# Altium schematic sheet Diesel_control.SchDoc
size A2; SheetNumber: 1; SheetTotal: 1
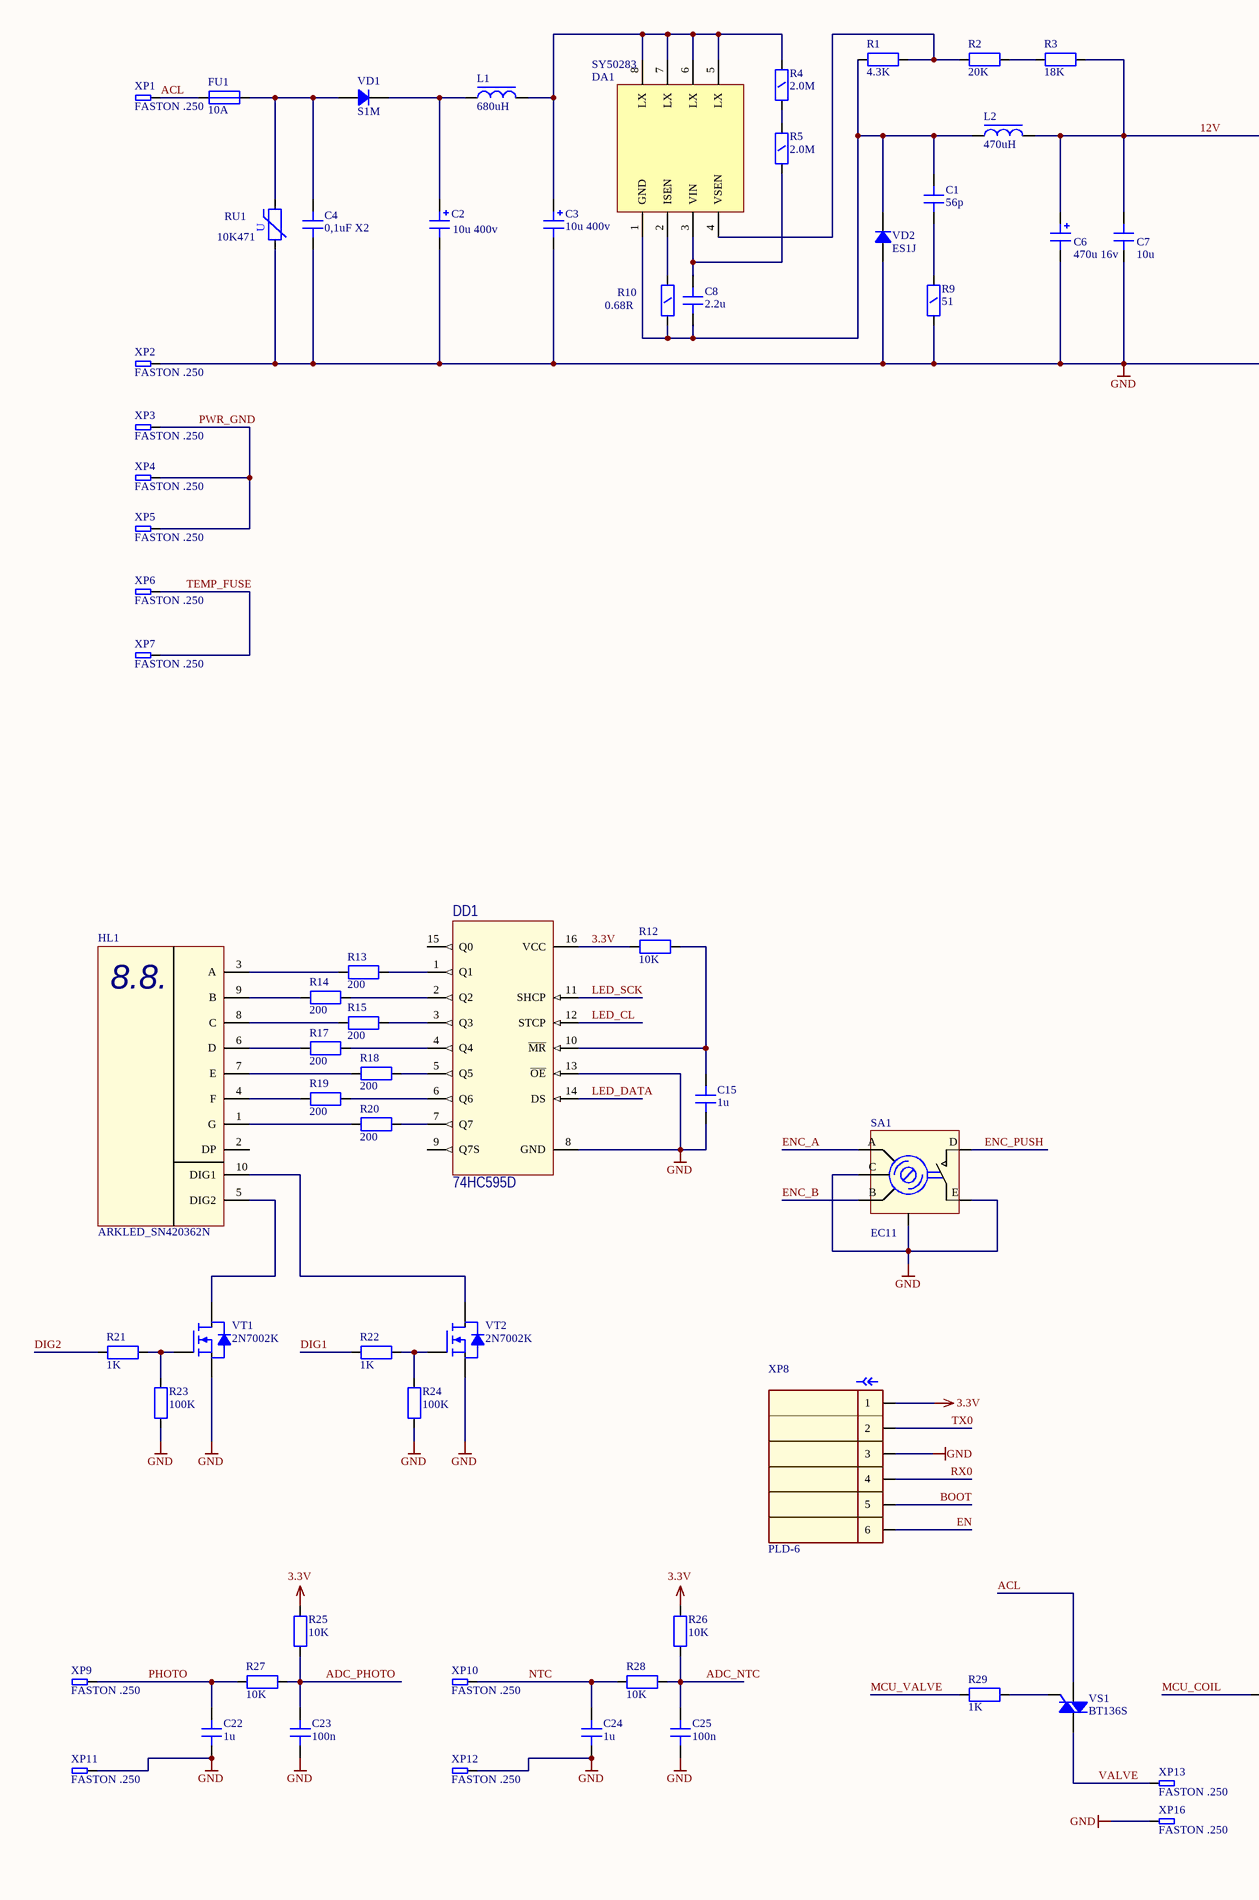
[diagram p0: Diesel_control.SchDoc, left]
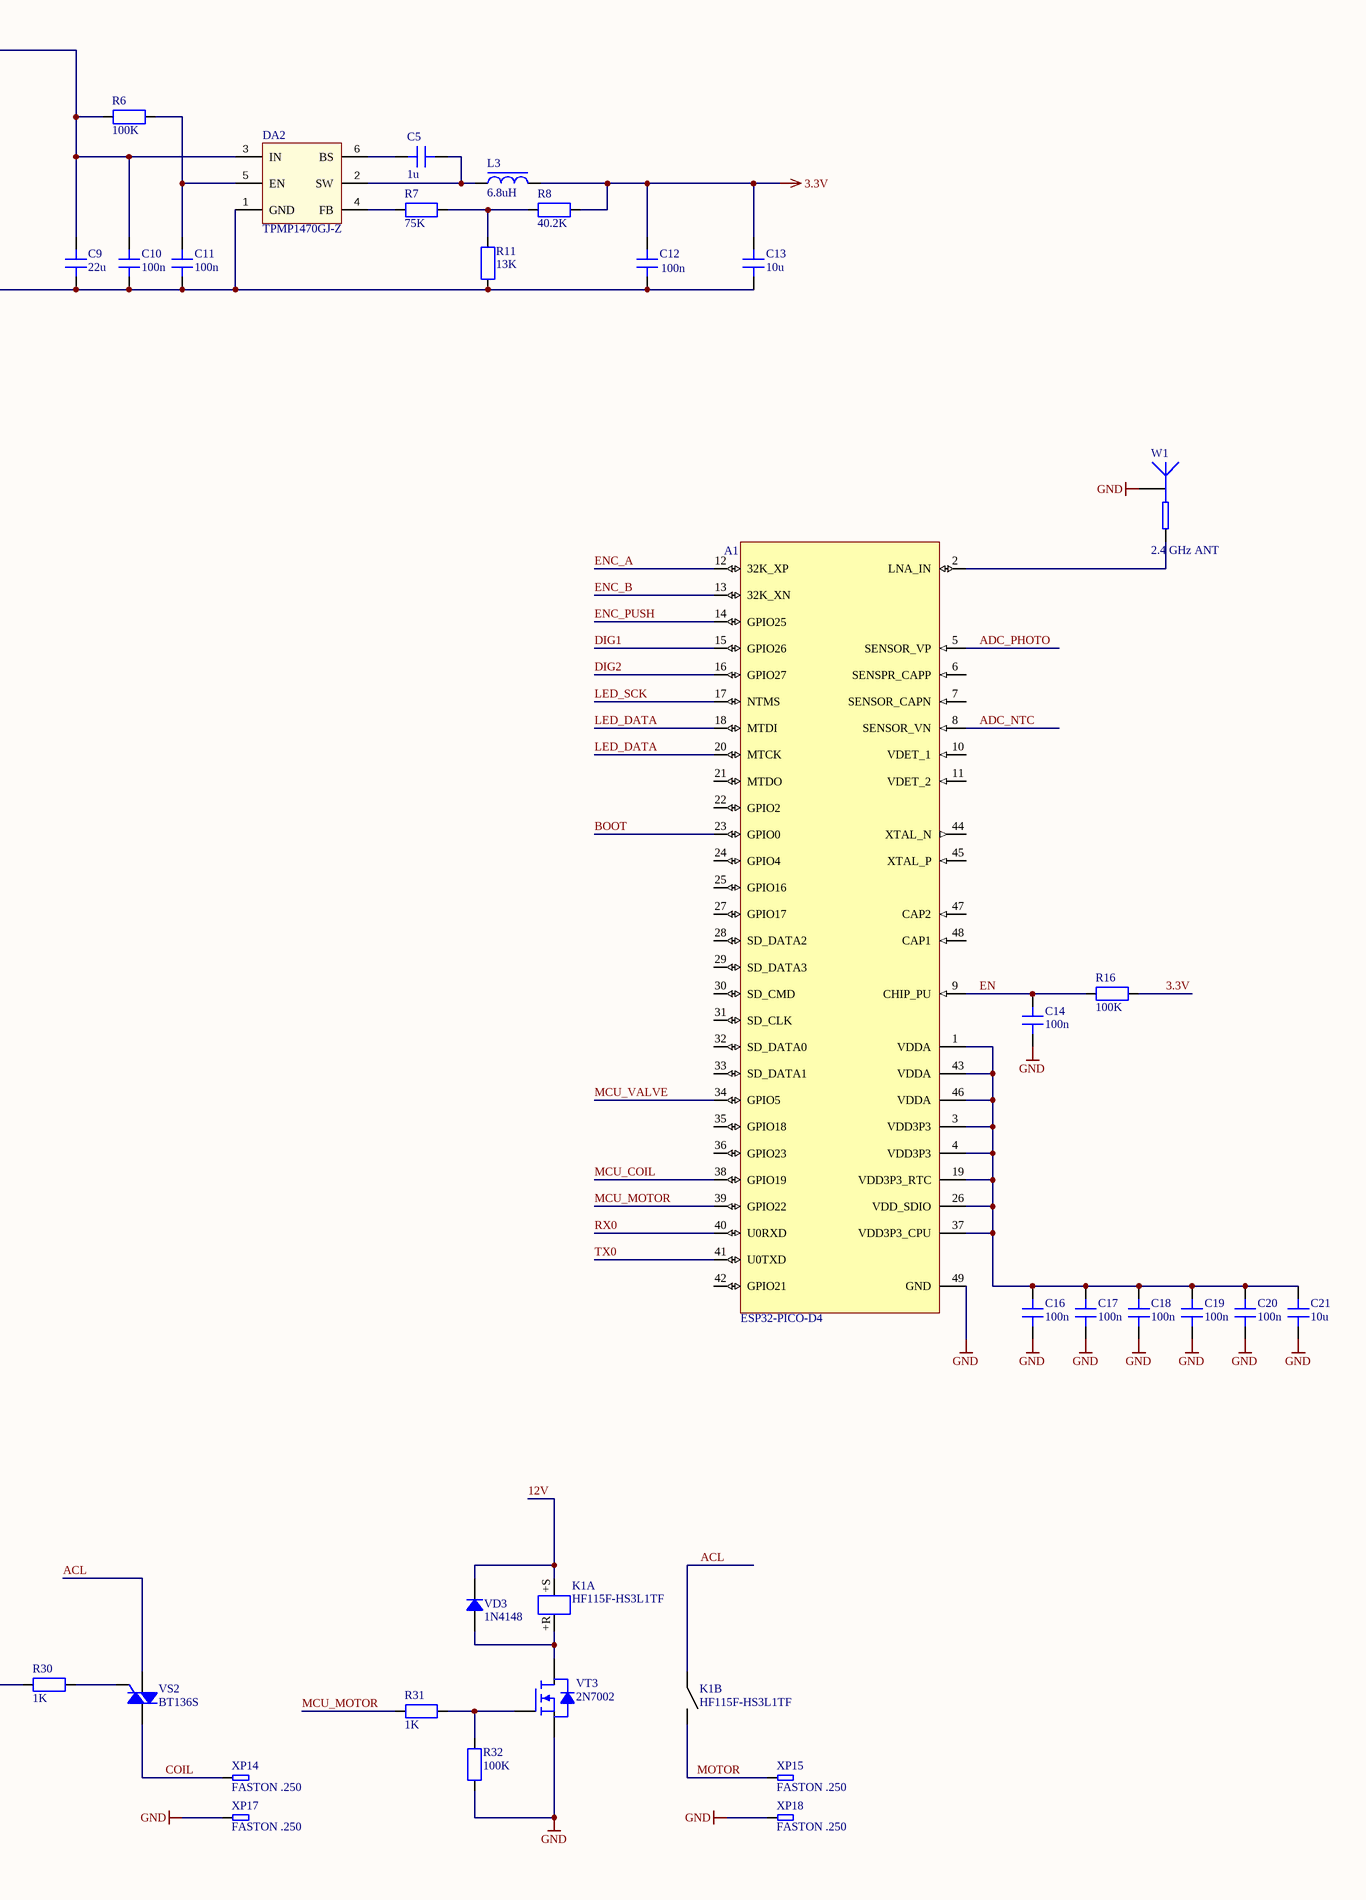
[diagram p1: Diesel_control.SchDoc, right]

## Parts
A1  ESP32-PICO-D4  [ESP32_PICO_D4]
C1  56p  [C1206]
C2  10u 400v  [CE12.5X20-P5.0]
C3  10u 400v  [CE12.5X20-P5.0]
C4  0,1uF X2  [CAP_FILM_6X13X12(PITCH=10mm)]
C5  1u  [C0603]
C6  470u 16v  [CE8x12MM-P3.5]
C7  10u  [C1206]
C8  2.2u  [C0603]
C9  22u  [C1206]
C10  100n  [C0603]
C11  100n  [C0603]
C12  100n  [C0603]
C13  10u  [C0805]
C14  100n  [C0603]
C15  1u  [C0603]
C16  100n  [C0603]
C17  100n  [C0603]
C18  100n  [C0603]
C19  100n  [C0603]
C20  100n  [C0603]
C21  10u  [C0603]
C22  1u  [C0603]
C23  100n  [C0603]
C24  1u  [C0603]
C25  100n  [C0603]
DA1  SY50283  [SO-8]
DA2  TPMP1470GJ-Z  [SOT-23-6]
DD1  74HC595D  [SO-16]
FU1  10A  [Axial_215]
HL1  ARKLED_SN420362N  [7_seg_double_CK]
K1  HF115F-HS3L1TF  [HF115F-A]  (parts A,B of 2)
L1  680uH  [PK0608]
L2  470uH  [GCRH129]
L3  6.8uH  [SCCD54]
R1  4.3K  [R0603]
R2  20K  [R0603]
R3  18K  [R0603]
R4  2.0M  [R1206]
R5  2.0M  [R1206]
R6  100K  [R0603]
R7  75K  [R0603]
R8  40.2K  [R0603]
R9  51  [R1206]
R10  0.68R  [R1206]
R11  13K  [R0603]
R12  10K  [R0603]
R13  200  [R0603]
R14  200  [R0603]
R15  200  [R0603]
R16  100K  [R0603]
R17  200  [R0603]
R18  200  [R0603]
R19  200  [R0603]
R20  200  [R0603]
R21  1K  [R0603]
R22  1K  [R0603]
R23  100K  [R0603]
R24  100K  [R0603]
R25  10K  [R0603]
R26  10K  [R0603]
R27  10K  [R0603]
R28  10K  [R0603]
R29  1K  [R0603]
R30  1K  [R0603]
R31  1K  [R0603]
R32  100K  [R0603]
RU1  10K471  [Varistor_D10_P=7.5mm]
SA1  EC11  [EC11-20F]
VD1  S1M  [SMA_DIODE]
VD2  ES1J  [SMA_DIODE]
VD3  1N4148  [SOD-323_DIODE]
VS1  BT136S  [TO-252-3]
VS2  BT136S  [TO-252-3]
VT1  2N7002K  [SOT-23-3]
VT2  2N7002K  [SOT-23-3]
VT3  2N7002  [SOT-23-3]
W1  2.4 GHz ANT  [PIFA_2.4MHz]  (no BOM)
XP1  FASTON .250  [1217861-1]
XP2  FASTON .250  [1217861-1]
XP3  FASTON .250  [1217861-1]
XP4  FASTON .250  [1217861-1]
XP5  FASTON .250  [1217861-1]
XP6  FASTON .250  [1217861-1]
XP7  FASTON .250  [1217861-1]
XP8  PLD-6  [PLD-6]
XP9  FASTON .250  [1217861-1]
XP10  FASTON .250  [1217861-1]
XP11  FASTON .250  [1217861-1]
XP12  FASTON .250  [1217861-1]
XP13  FASTON .250  [1217861-1]
XP14  FASTON .250  [1217861-1]
XP15  FASTON .250  [1217861-1]
XP16  FASTON .250  [1217861-1]
XP17  FASTON .250  [1217861-1]
XP18  FASTON .250  [1217861-1]

## Nets
3.3V: DD1.16(VCC) R12.1 R16.2 R25.2 R26.2 XP8.1
GND: A1.49(GND) C2.- C3.- C4.1 C6.- C7.1 C9.1 C10.1 C11.1 C12.1 C13.1 C14.1 C15.1 C16.1 C17.1 C18.1 C19.1 C20.1 C21.1 C22.1 C23.1 C24.1 C25.1 DA2.1(GND) DD1.8(GND) DD1.13(~{OE}) R9.1 R11.1 R23.1 R24.1 R32.1 RU1.1 SA1.C SA1.E SA1.GND VD2.A VT1.Z(S) VT2.Z(S) VT3.Z(S) W1.1 XP2.1 XP8.3 XP11.1 XP12.1 XP16.1 XP17.1 XP18.1
12V: C6.+ C7.2 C9.2 C10.2 DA2.3(IN) K1.A1(+S) L2.2 R3.2 R6.1 VD3.C
ACL: FU1.1 K1.11 VS1.X(A1) VS2.X(A1) XP1.1
ADC_NTC: A1.8(SENSOR_VN) C25.2 R26.1 R28.2
ADC_PHOTO: A1.5(SENSOR_VP) C23.2 R25.1 R27.2
BOOT: A1.23(GPIO0) XP8.5
COIL: VS2.Y(A2) XP14.1
DIG1: A1.15(GPIO26) R22.1
DIG2: A1.16(GPIO27) R21.1
EN: A1.9(CHIP_PU) C14.2 R16.1 XP8.6
ENC_A: A1.12(32K_XP) SA1.A
ENC_B: A1.13(32K_XN) SA1.B
ENC_PUSH: A1.14(GPIO25) SA1.D
LED_CL: DD1.12(STCP)
LED_DATA: A1.18(MTDI) A1.20(MTCK) DD1.14(DS)
LED_SCK: A1.17(NTMS) DD1.11(SHCP)
MCU_COIL: A1.38(GPIO19) R30.1
MCU_MOTOR: A1.39(GPIO22) R31.2
MCU_VALVE: A1.34(GPIO5) R29.1
MOTOR: K1.14 XP15.1
NTC: C24.2 R28.1 XP10.1
PHOTO: C22.2 R27.1 XP9.1
PWR_GND: XP3.1 XP4.1 XP5.1
RX0: A1.40(U0RXD) XP8.4
TEMP_FUSE: XP6.1 XP7.1
TX0: A1.41(U0TXD) XP8.2
VALVE: VS1.Y(A2) XP13.1
NetA1_1: A1.1(VDDA) A1.3(VDD3P3) A1.4(VDD3P3) A1.19(VDD3P3_RTC) A1.26(VDD_SDIO) A1.37(VDD3P3_CPU) A1.43(VDDA) A1.46(VDDA) C16.2 C17.2 C18.2 C19.2 C20.2 C21.2
NetA1_2: A1.2(LNA_IN) W1.2
NetC1_1: C1.1 R9.2
NetC1_2: C1.2 C8.1 DA1.1(GND) L2.1 R1.1 R10.1 VD2.C
NetC2_+: C2.+ L1.1 VD1.C
NetC3_+: C3.+ DA1.5(LX) DA1.6(LX) DA1.7(LX) DA1.8(LX) L1.2 R4.2
NetC4_2: C4.2 FU1.2 RU1.2 VD1.A
NetC5_1: C5.1 DA2.6(BS)
NetC5_2: C5.2 DA2.2(SW) L3.1
NetC8_2: C8.2 DA1.3(VIN) R5.1
NetC11_2: C11.2 DA2.5(EN) R6.2
NetC12_2: C12.2 C13.2 L3.2 R8.2
NetC15_2: C15.2 DD1.10(~{MR}) R12.2
NetDA1_2: DA1.2(ISEN) R10.2
NetDA1_4: DA1.4(VSEN) R1.2 R2.1
NetDA2_4: DA2.4(FB) R7.1
NetDD1_1: DD1.1(Q1) R13.2
NetDD1_2: DD1.2(Q2) R14.2
NetDD1_3: DD1.3(Q3) R15.2
NetDD1_4: DD1.4(Q4) R17.2
NetDD1_5: DD1.5(Q5) R18.2
NetDD1_6: DD1.6(Q6) R19.2
NetDD1_7: DD1.7(Q7) R20.2
NetHL1_1: HL1.1(G) R20.1
NetHL1_3: HL1.3(A) R13.1
NetHL1_4: HL1.4(F) R19.1
NetHL1_5: HL1.5(DIG2) VT1.Y(D)
NetHL1_6: HL1.6(D) R17.1
NetHL1_7: HL1.7(E) R18.1
NetHL1_8: HL1.8(C) R15.1
NetHL1_9: HL1.9(B) R14.1
NetHL1_10: HL1.10(DIG1) VT2.Y(D)
NetK1_A2: K1.A2(+R) VD3.A VT3.Y(D)
NetR2_2: R2.2 R3.1
NetR4_1: R4.1 R5.2
NetR7_2: R7.2 R8.1 R11.2
NetR21_2: R21.2 R23.2 VT1.X(G)
NetR22_2: R22.2 R24.2 VT2.X(G)
NetR29_2: R29.2 VS1.Z(G)
NetR30_2: R30.2 VS2.Z(G)
NetR31_1: R31.1 R32.2 VT3.X(G)

Not connected (* = marked no-connect by the designer): A1 6(SENSPR_CAPP) 7(SENSOR_CAPN) 10(VDET_1) 11(VDET_2) 21(MTDO) 22(GPIO2) 24(GPIO4) 25(GPIO16) 27(GPIO17) 28(SD_DATA2) 29(SD_DATA3) 30(SD_CMD) 31(SD_CLK) 32(SD_DATA0) 33(SD_DATA1) 35(GPIO18) 36(GPIO23) 42(GPIO21) 44(XTAL_N) 45(XTAL_P) 47(CAP2) 48(CAP1); DD1 9(Q7S) 15(Q0); HL1 2(DP)

## Notes on the sheet
- Labels drawn without touching a wire or pin: 3.3V
- (in symbol 1436) U
- (in symbol 3577) 8.8.

## Library data of the parts
A1 = 3638: Bluetooth, WiFi 802.11b/g/n, Bluetooth v4.2 + EDR, Class 1, 2 and 3 Transceiver Module 2.4GHz ~ 2.5GHz  Surface Mount; Manufacturer: Expressif; ID: 3638; LCPN: C193707; Type: Modules; MFPN: ESP32-PICO-D4; Value: ESP32-PICO-D4; Footprint Type: SMD; Supplier: LC; URL: https://lcsc.com/product-detail/Others_Espressif-Systems-ESP32-PICO-D4_C193707.html; Symbol: ESP32_PICO_D4
C1 = 3645: 56pF ±5% 1kV C0G,NP0 1206 Multilayer Ceramic Capacitors MLCC - SMD/SMT RoHS; Manufacturer: IHHEC(HOLY STONE ENTERPRISE CO., LTD); ID: 3645; MFPN: C1206N560J102T; LCPN: C105999; Type: Capacitors; Value: 56p; Footprint Type: SMD; Supplier: LC; URL: https://lcsc.com/product-detail/Multilayer-Ceramic-Capacitors-MLCC-SMD-SMT_IHHEC-HOLY-STONE-ENTERPRISE-CO-LTD-C1206N560J102T_C105999.html; Symbol: Capacitor
C2 C3 = 1407: 10u, 400v, Aluminium electrolitic capaсitor, radial, D=12.5mm, H=20mm, +105°C; ID: 1407; Type: Capacitors; Value: 10u; Footprint Type: TH; Symbol: Capacitor_polarised
C4 = 3608: Film Capacitor X2, 310V 0,1uF ±10% -40℃...+110℃; Manufacturer: KNSCHA; ID: 3608; Type: Capacitors; MFPN: MPX104K31C3KN15600; Value: 100n; LCPN: C489079; Footprint Type: TH; Supplier: LC; URL: https://lcsc.com/product-detail/Suppression-Capacitors_KNSCHA-MPX104K31C3KN15600_C489079.html; Symbol: Capacitor
C5 C15 C22 C24 = 1246: Cap Ceramic, 0603, ±10%, 50V, X7R (X5R), -55 +125C (-55 +85C); ID: 1246; Type: Capacitors; MFPN: CL10A105KO8NNNC; LCPN: C1592; Value: 1u; Footprint Type: SMD; URL: https://lcsc.com/product-detail/Multilayer-Ceramic-Capacitors-MLCC-SMD-SMT_Samsung-Electro-Mechanics-CL10A105KO8NNNC_C1592.html; Symbol: Capacitor
C6 = 1428: 470u, 16v, Aluminium electrolitic capaсitor, radial, D=8mm, H=12mm, +105°C; ID: 1428; Type: Capacitors; Value: 470u; Footprint Type: TH; Symbol: Capacitor_polarised
C7 = 1383: Cap Ceramic, 1206, ±10%, 25V, X7R (X5R), -55 +125C (-55 +85C); ID: 1383; Type: Capacitors; MFPN: CL31A106KBHNNNE; LCPN: C13585; Value: 10u; Footprint Type: SMD; URL: https://lcsc.com/product-detail/Multilayer-Ceramic-Capacitors-MLCC-SMD-SMT_Samsung-Electro-Mechanics-CL31A106KBHNNNE_C13585.html; Symbol: Capacitor
C8 = 1250: Cap Ceramic, 0603, ±10%, 25V, X7R (X5R), -55 +125C (-55 +85C); ID: 1250; Type: Capacitors; Value: 2.2u; Footprint Type: SMD; Symbol: Capacitor
C9 = 1384: Cap Ceramic, 1206, ±10%, 25V, X7R (X5R), -55 +125C (-55 +85C); ID: 1384; Type: Capacitors; Value: 22u; Footprint Type: SMD; Symbol: Capacitor
C10-C12 C14 C16-C20 C23 C25 = 1234: Cap Ceramic, 0603, ±10%, 50V, X7R (X5R), -55 +125C (-55 +85C); ID: 1234; Type: Capacitors; MFPN: 0603B104K500NT; LCPN: C187860; Value: 100n; Footprint Type: SMD; URL: https://lcsc.com/product-detail/Multilayer-Ceramic-Capacitors-MLCC-SMD-SMT_YAGEO-CC0603KRX7R9BB104_C14663.html; Symbol: Capacitor
C13 = 1331: Cap Ceramic, 0805, ±10%, 50V, X7R (X5R), -55 +125C (-55 +85C); ID: 1331; Type: Capacitors; LCPN: C17024; Value: 10u; Footprint Type: SMD; Symbol: Capacitor
C21 = 1258: Cap Ceramic, 0603, ±10%, 6.3V, X7R (X5R), -55 +125C (-55 +85C); ID: 1258; Type: Capacitors; Value: 10u; Footprint Type: SMD; Symbol: Capacitor
DA1 = 3641: Buck Regulator; Manufacturer: Silergy Corp; ID: 3641; MFPN: SY50283FAC; LCPN: C492740; Type: Microschemes; Value: SY50283; Footprint Type: SMD; Supplier: LC; URL: https://lcsc.com/product-detail/LED-Drivers_Silergy-Corp-SY50283FAC_C492740.html; Symbol: SY50283
DA2 = 3646: SOT23-6 DC-DC Converters RoHS; Manufacturer: TECH PUBLIC; ID: 3646; LCPN: C558426; Type: Microschemes; MFPN: TPMP1470GJ-Z; Value: TPMP1470GJ-Z; Footprint Type: SMD; Supplier: LC; URL: https://lcsc.com/product-detail/DC-DC-Converters_TECH-PUBLIC-TPMP1470GJ-Z_C558426.html; Symbol: TPMP1470GJ-Z
DD1 = 3557: Shift Register Serial to parallel, serial SOIC-16_150mil; Manufacturer: Shenzhen Fuman Elec; ID: 3557; MFPN: 74HC595D,118; LCPN: C2798023; Type: Microschemes; Value: 74HC595D; Footprint Type: SMD; Supplier: LC; URL: https://lcsc.com/product-detail/74-Series_Nexperia-74HC595D-118_C5947.html; Symbol: 74HC595D
FU1 = 3611: Glass Tube Fuse Delayed blow/Slow Blow 10A 250V Axial,5x20mm; Manufacturer: Littelfuse; ID: 3611; MFPN: 0218010.MXEP; LCPN: C142774; Type: Fuses; Value: 10A; Footprint Type: TH; Supplier: LC; URL: https://lcsc.com/product-detail/Cartridge-Fuses_Littelfuse-0218010-MXEP_C142774.html; Symbol: Fuse
HL1 = 3577: 2 0.36''(9.14mm) Cathode(Negative electrode) Red 633nm Through Hole Led Segment Display RoHS; Manufacturer: ARKLED(Wuxi ARK Tech Elec); ID: 3577; Type: Displays; LCPN: C193138; MFPN: SN420362N; Value: ARKLED_SN420362N; Footprint Type: TH; Supplier: LC; URL: https://lcsc.com/product-detail/Led-Segment-Display_ARKLED-Wuxi-ARK-Tech-Elec-SN420362N_C193138.html; Symbol: 7_segment_double_CK
K1 = 1496: Miniature High Power Latching Relay, 1 Coil, 20A, 5VDC; Manufacturer: HONGFA RELAY; MFPN: HF115F-L/5-HS3L1TF; ID: 1496; Value: HF115F-L/12-HS3L1TF; Supplier: BIG; Type: Relays; Footprint Type: TH; Symbol: RELAY_POL_L1_1A
L1 = 3642: 680uH ±20% 250mA 2.5Ω Power Inductors RoHS; Manufacturer: SXN(Shun Xiang Nuo Elec); ID: 3642; MFPN: PK0608-681MB; LCPN: C400306; Type: Inductors; Value: 680uH; Footprint Type: TH; Supplier: LC; URL: https://lcsc.com/product-detail/Power-Inductors_SXN-Shun-Xiang-Nuo-Elec-PK0608-681MB_C400306.html; Symbol: Drossel
L2 = 3643: 470uH ±20% 1A 600mΩ SMD,12.3x12.3x10mm(max) Power Inductors RoHS; Manufacturer: GLE; ID: 3643; MFPN: GCRH129-471MC; LCPN: C439430; Type: Inductors; Value: 470uH; Footprint Type: SMD; Supplier: LC; URL: https://lcsc.com/product-detail/Power-Inductors_GLE-GCRH129-471MC_C439430.html; Symbol: Drossel
L3 = 3647: 6.8uH ±20% 2A 70mΩ SMD,5.8x5.2x4.5mm Power Inductors RoHS; Manufacturer: Yanchuang; ID: 3647; MFPN: SCCD54-6R8MT; LCPN: C532871; Type: Inductors; Value: 6.8uH; Footprint Type: SMD; Supplier: LC; Symbol: Drossel
R1 = 88: Res, 0603, 1%, 1/10W; Manufacturer: FH(Guangdong Fenghua Advanced Tech); ID: 88; MFPN: RS-03K4301FT; LCPN: C310281; Type: Resistors; Value: 4.3K; Footprint Type: SMD; Supplier: JLC; URL: https://lcsc.com/product-detail/Chip-Resistor-Surface-Mount_FH-Guangdong-Fenghua-Advanced-Tech-RS-03K4301FT_C310281.html; Symbol: Resistor
R2 = 104: Res, 0603, 1%, 1/10W; Manufacturer: YAGEO; ID: 104; MFPN: RC0603FR-0720KL; LCPN: C105575; Type: Resistors; Value: 20K; Footprint Type: SMD; Supplier: JLC; URL: https://lcsc.com/product-detail/Chip-Resistor-Surface-Mount_20KR-2002-1_C105575.html; Symbol: Resistor
R3 = 103: Res, 0603, 1%, 1/10W; Manufacturer: FH(Guangdong Fenghua Advanced Tech); ID: 103; MFPN: RS-03K1802FT; LCPN: C140113; Type: Resistors; Value: 18K; Footprint Type: SMD; Supplier: JLC; URL: https://lcsc.com/product-detail/Chip-Resistor-Surface-Mount_FH-Guangdong-Fenghua-Advanced-Tech-RS-03K1802FT_C140113.html; Symbol: Resistor
R4 R5 = 490: Res, 1206, 5%, 1/4W; ID: 490; Type: Resistors; Value: 2.0M; Footprint Type: SMD; Symbol: Resistor_1/4W
R6 R16 R23 R24 R32 = 121: Res, 0603, 1%, 1/10W; Manufacturer: UNI-ROYAL(Uniroyal Elec); ID: 121; MFPN: 0603WAF1003T5E; LCPN: C25803; Type: Resistors; Value: 100K; Footprint Type: SMD; Supplier: JLC; URL: https://lcsc.com/product-detail/Chip-Resistor-Surface-Mount_UNI-ROYAL-Uniroyal-Elec-0603WAF1003T5E_C25803.html; Symbol: Resistor
R7 = 118: Res, 0603, 1%, 1/10W; Manufacturer: UNI-ROYAL(Uniroyal Elec); ID: 118; MFPN: 0603WAF7502T5E; LCPN: C23242; Type: Resistors; Value: 75K; Footprint Type: SMD; Supplier: JLC; URL: https://lcsc.com/product-detail/Chip-Resistor-Surface-Mount_UNI-ROYAL-Uniroyal-Elec-0603WAF7502T5E_C23242.html; Symbol: Resistor
R8 = 3649: Res, 0603, 1%, 1/10W; Manufacturer: UNI-ROYAL(Uniroyal Elec); ID: 3649; MFPN: 0603WAF4022T5E; LCPN: C12447; Type: Resistors; Value: 40.2K; Footprint Type: SMD; Supplier: LC; Symbol: Resistor
R9 = 380: Res, 1206, 1%, 1/4W; ID: 380; Type: Resistors; Value: 51; Footprint Type: SMD; Symbol: Resistor_1/4W
R10 = 3572: Res, 1206, 5%, 1/4W; Manufacturer: UNI-ROYAL(Uniroyal Elec); ID: 3572; MFPN: 1206W4J0000T5E; Value: 0; LCPN: C38869; Type: Resistors; Footprint Type: SMD; Supplier: JLC; URL: https://lcsc.com/product-detail/Chip-Resistor-Surface-Mount_UNI-ROYAL-Uniroyal-Elec-1206W4J0000T5E_C38869.html; Symbol: Resistor_1/4W
R11 = 100: Res, 0603, 1%, 1/10W; Manufacturer: UNI-ROYAL(Uniroyal Elec); ID: 100; MFPN: 0603WAF1302T5E; LCPN: C22797; Type: Resistors; Value: 13K; Footprint Type: SMD; Supplier: JLC; URL: https://lcsc.com/product-detail/Chip-Resistor-Surface-Mount_UNI-ROYAL-Uniroyal-Elec-0603WAF1302T5E_C22797.html; Symbol: Resistor
R12 R25-R28 = 97: Res, 0603, 1%, 1/10W; Manufacturer: FH(Guangdong Fenghua Advanced Tech); ID: 97; MFPN: RS-03K1002FT; LCPN: C115324; Type: Resistors; Value: 10K; Footprint Type: SMD; Supplier: JLC; URL: https://lcsc.com/product-detail/Chip-Resistor-Surface-Mount_FH-Guangdong-Fenghua-Advanced-Tech-RS-03K1002FT_C115324.html; Symbol: Resistor
R13-R15 R17-R20 = 56: Res, 0603, 1%, 1/10W; Manufacturer: UNI-ROYAL(Uniroyal Elec); ID: 56; MFPN: 0603WAJ0201T5E; LCPN: C25217; Type: Resistors; Value: 200; Footprint Type: SMD; Supplier: JLC; URL: https://lcsc.com/product-detail/Chip-Resistor-Surface-Mount_UNI-ROYAL-Uniroyal-Elec-0603WAJ0201T5E_C25217.html; Symbol: Resistor
R21 R22 R29-R31 = 73: Res, 0603, 1%, 1/10W; Manufacturer: FH(Guangdong Fenghua Advanced Tech); ID: 73; MFPN: RS-03K1002FT; LCPN: C115325; Type: Resistors; Value: 1K; Footprint Type: SMD; Supplier: JLC; URL: https://lcsc.com/product-detail/Chip-Resistor-Surface-Mount_FH-Guangdong-Fenghua-Advanced-Tech-RS-03K1001FT_C115325.html; Symbol: Resistor
RU1 = 1436: VARISTOR, 385VDC, 300VAC, 0.4W, D10mm; ID: 1436; MFPN: VDR-10K471KH， -40/125度; Type: Resistors; Value: 10K471; Footprint Type: TH; Supplier: BIG; Symbol: Varistor
SA1 = 3626: Metal Shaft Type EC11 Series, 11mm Size; ID: 3626; Supplier: BIG; Type: Switches; Value: EC11; Footprint Type: TH; Symbol: EC11; Footprint: EC11
VD1 = 1475: Rectifier Diode, 1А, 800V, 1.8us; ID: 1475; Type: Diodes; LCPN: C64915; MFPN: S1M; Value: S1M; Footprint Type: SMD; Supplier: JLC; URL: https://lcsc.com/product-detail/Diodes-General-Purpose_MDD-Microdiode-Electronics-S1M_C64915.html; Symbol: Diode
VD2 = 3644: 600V 1A 1.7V 1A SMA(DO-214AC) Diodes - General Purpose RoHS; Manufacturer: BORN; ID: 3644; LCPN: C266561; Type: Diodes; MFPN: ES1J; Value: ES1J; Footprint Type: SMD; Supplier: LC; URL: https://lcsc.com/product-detail/Diodes-General-Purpose_BORN-ES1J_C266561.html; Symbol: Diode
VD3 = 1464: Small Signal Fast Switching Diode, 150mA, 75V; ID: 1464; Type: Diodes; MFPN: 1N4148WS; Value: 1N4148WS; LCPN: C108805; Footprint Type: SMD; Supplier: JLC; URL: https://lcsc.com/product-detail/Switching-Diode_Shandong-Jingdao-Microelectronics-1N4148WS_C108805.html; Symbol: Diode
VS1 VS2 = 3596: Two-way thyristor 600V 6A 1.45V 10mA TO-252-2(DPAK); Manufacturer: Changjiang Electronics Tech (CJ); ID: 3596; LCPN: C23427; Type: Diodes; MFPN: BT136S; Value: BT136S; Footprint Type: SMD; Supplier: LC; URL: https://lcsc.com/product-detail/Thyristors-TRIACs_Changjiang-Electronics-Tech-CJ-BT136S_C23427.html; Symbol: Triac; Footprint: DPAK
VT1 VT2 = 1471: HEXFET Power MOSFET N-CH; ID: 1471; Type: Transistors; LCPN: C38161; MFPN: 2N7002K; Value: 2N7002K; Footprint Type: SMD; Supplier: LC; URL: https://lcsc.com/product-detail/MOSFET_Changjiang-Electronics-Tech-CJ-2N7002K_C38161.html; Symbol: N-MOS
VT3 = 1470: HEXFET Power MOSFET N-CH; ID: 1470; Type: Transistors; MFPN: GM7002E; LCPN: C8545; Value: 2N7002; Footprint Type: SMD; Supplier: JLC; Symbol: N-MOS
W1 = 3625: 2.4 GHz PCB Trace WI-FI Anthenna 50 Ohm; ID: 3625; Type: Anthennas; Value: 2.4 GHz ANT; Symbol: PIFA_ANTHENNA
XP1-XP7 XP9-XP18 = 1446: TERMINAL, TAB, 6.35MM x 0.81MM, SOLDER; ID: 1446; Value: 1217861-1; Type: Connectors; MFPN: 1217861-1; Footprint Type: TH; Supplier: BIG; Symbol: TERMINAL_TAB
XP8 = 3581: 2x3 Male pld pins 2.54; ID: 3581; Type: Connectors; Value: PLD-6; Footprint Type: TH; Symbol: MALE_6PIN